# Altium schematic sheet 1_classyTKL_ALPS_top.SchDoc
size A4; Engineer: 4pplet; Address1: github.com/4pplet/classytkl; Address2: Licence: CERN-OHL-S; Revision: A3; SheetNumber: 1; SheetTotal: 3; ProjectName: waffling60
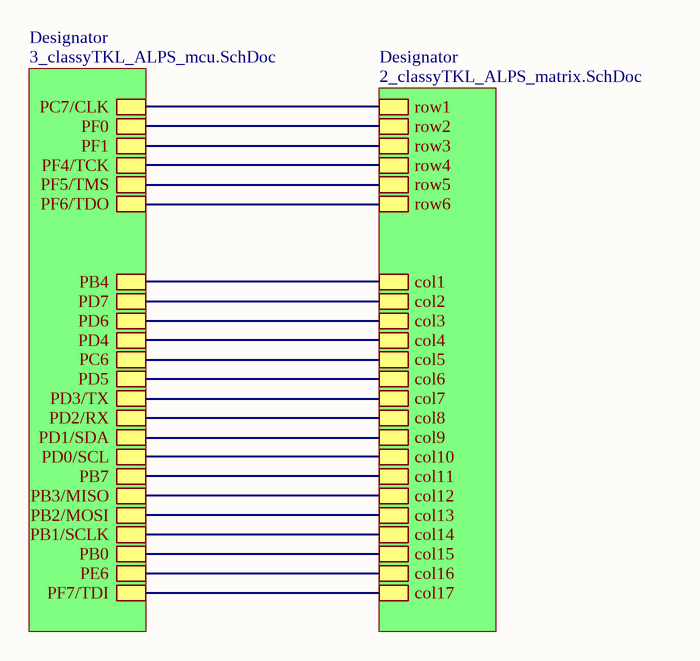
[diagram p0: 1_classyTKL_ALPS_top.SchDoc]

## Sub-sheets
Designator = 3_classyTKL_ALPS_mcu.SchDoc: PD5, PB4, PD6, PB0, PB2/MOSI, PB3/MISO, PD7, PC7/CLK, PE6, PF0, PF1, PF5/TMS, PD2/RX, PF4/TCK, PF7/TDI, PF6/TDO, PD4, PB1/SCLK, PD0/SCL, PC6, PB7, PD1/SDA, PD3/TX
Designator = 2_classyTKL_ALPS_matrix.SchDoc: col6, col8, col5, col7, col3, col2, col1, col4, col9, row3, row1, row4, row2, row6, row5, col10, col11, col14, col15, col13, col12, col16, col17

## Nets
(unnamed): sheet Designator/PD5, sheet Designator/col6
(unnamed): sheet Designator/PB4, sheet Designator/col1
(unnamed): sheet Designator/PD6, sheet Designator/col3
(unnamed): sheet Designator/PB0, sheet Designator/col15
(unnamed): sheet Designator/PB2/MOSI, sheet Designator/col13
(unnamed): sheet Designator/PB3/MISO, sheet Designator/col12
(unnamed): sheet Designator/PD7, sheet Designator/col2
(unnamed): sheet Designator/PC7/CLK, sheet Designator/row1
(unnamed): sheet Designator/PE6, sheet Designator/col16
(unnamed): sheet Designator/PF0, sheet Designator/row2
(unnamed): sheet Designator/PF1, sheet Designator/row3
(unnamed): sheet Designator/PF5/TMS, sheet Designator/row5
(unnamed): sheet Designator/PD2/RX, sheet Designator/col8
(unnamed): sheet Designator/PF4/TCK, sheet Designator/row4
(unnamed): sheet Designator/PF7/TDI, sheet Designator/col17
(unnamed): sheet Designator/PF6/TDO, sheet Designator/row6
(unnamed): sheet Designator/PD4, sheet Designator/col4
(unnamed): sheet Designator/PB1/SCLK, sheet Designator/col14
(unnamed): sheet Designator/PD0/SCL, sheet Designator/col10
(unnamed): sheet Designator/PC6, sheet Designator/col5
(unnamed): sheet Designator/PB7, sheet Designator/col11
(unnamed): sheet Designator/PD1/SDA, sheet Designator/col9
(unnamed): sheet Designator/PD3/TX, sheet Designator/col7

## Notes on the sheet
- Title
- Size:
- Date:
- A4
- Number:
- Time:
- Revision:
- Sheet
- of
- File: